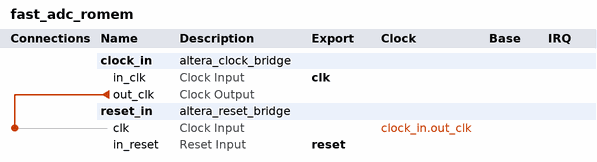
[diagram p0: system contents]
# Platform Designer (Qsys) system fast_adc_romem, Cyclone 10 GX 10CX105YF672E5G
# Parameters at their usual value, and those the tool derives, are not listed.
package require -exact qsys 1.0
create_system fast_adc_romem
set_project_property DEVICE_FAMILY {Cyclone 10 GX}
set_project_property DEVICE 10CX105YF672E5G

add_component clock_in ip/fast_adc_romem/fast_adc_romem_clock_in.ip altera_clock_bridge clock_in 18.1

add_component reset_in ip/fast_adc_romem/fast_adc_romem_reset_in.ip altera_reset_bridge reset_in 18.1
load_component reset_in
set_component_parameter_value ACTIVE_LOW_RESET 0
set_component_parameter_value SYNCHRONOUS_EDGES deassert
set_component_parameter_value SYNC_RESET 0
save_component

# connections
add_connection clock_in.out_clk reset_in.clk clock

# exported interfaces
add_interface clk clock sink
set_interface_property clk EXPORT_OF clock_in.in_clk
add_interface reset reset sink
set_interface_property reset EXPORT_OF reset_in.in_reset

set_interconnect_requirement {$system} qsys_mm.clockCrossingAdapter HANDSHAKE
set_interconnect_requirement {$system} qsys_mm.enableEccProtection FALSE
set_interconnect_requirement {$system} qsys_mm.insertDefaultSlave FALSE
set_interconnect_requirement {$system} qsys_mm.maxAdditionalLatency 1

save_system fast_adc_romem.qsys
